# Altium schematic sheet 外围电路.SchDoc
size A4
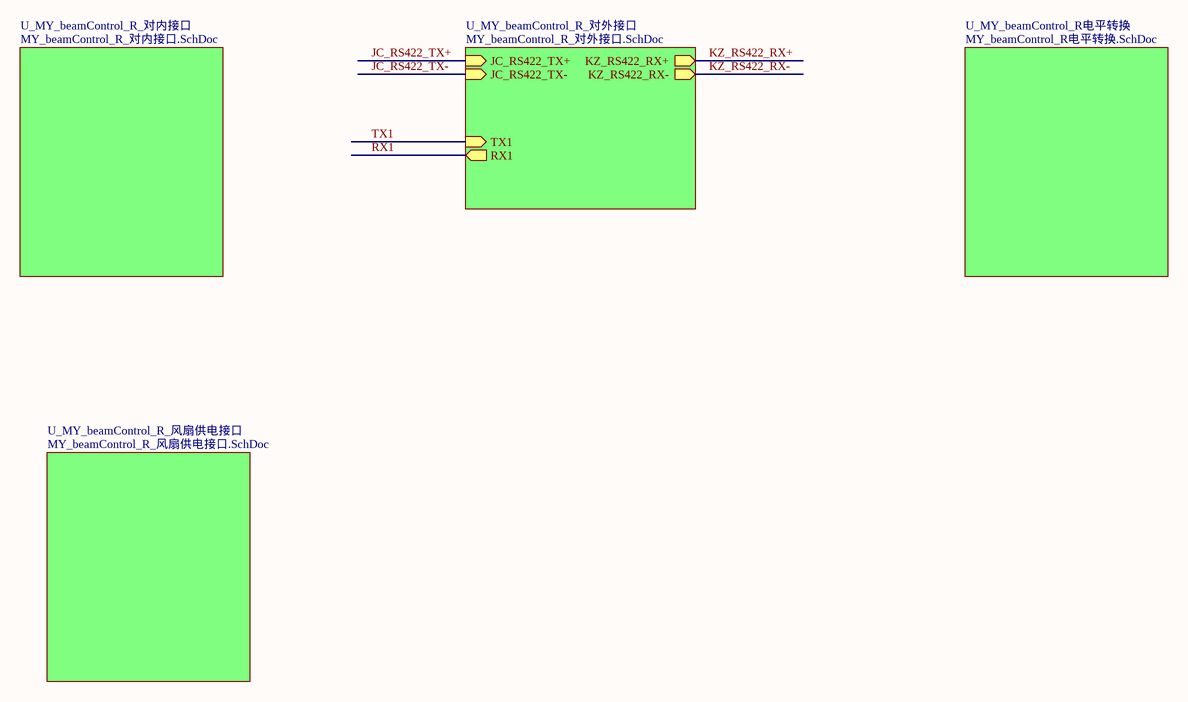
[diagram p0: 外围电路.SchDoc]

## Sub-sheets
U_MY_beamControl_R_对内接口 = MY_beamControl_R_对内接口.SchDoc: no entries
U_MY_beamControl_R_对外接口 = MY_beamControl_R_对外接口.SchDoc: JC_RS422_TX+ (in), JC_RS422_TX- (in), KZ_RS422_RX+ (out), KZ_RS422_RX- (out), RX1 (out), TX1 (in)
U_MY_beamControl_R_风扇供电接口 = MY_beamControl_R_风扇供电接口.SchDoc: no entries
U_MY_beamControl_R电平转换 = MY_beamControl_R电平转换.SchDoc: no entries

## Nets
JC_RS422_TX+: sheet U_MY_beamControl_R_对外接口/JC_RS422_TX+
JC_RS422_TX-: sheet U_MY_beamControl_R_对外接口/JC_RS422_TX-
KZ_RS422_RX+: sheet U_MY_beamControl_R_对外接口/KZ_RS422_RX+
KZ_RS422_RX-: sheet U_MY_beamControl_R_对外接口/KZ_RS422_RX-
RX1: sheet U_MY_beamControl_R_对外接口/RX1
TX1: sheet U_MY_beamControl_R_对外接口/TX1